# Altium project Motor_Driver.PrjPcb
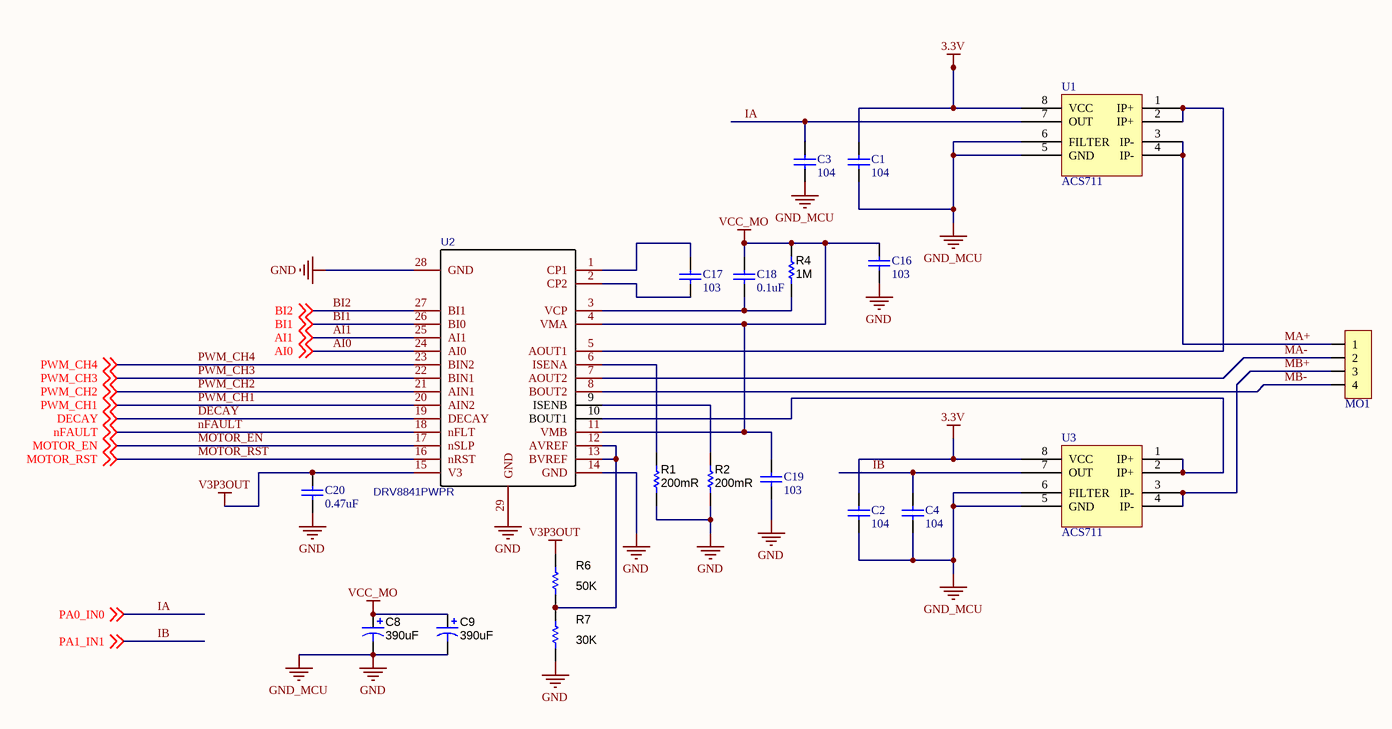
[diagram p0: H_bridge.SchDoc]
2 sheets, 41 parts. Net scope: global (net labels, ports and power ports of the same name join across sheets).
Board files: PCB.PcbDoc, PCB_Step.PcbDoc
Sheets:
  H_bridge.SchDoc
  MCU.SchDoc

## Sheet H_bridge.SchDoc
size B

### Parts
C1  104  [0805_HV]
C2  104  [0805_HV]
C3  104  [0805_HV]
C4  104  [0805_HV]
C8  390uF  [CP1/3.0]
C9  390uF  [CP1/3.0]
C16  103  [0805_HV]
C17  103  [0805_HV]
C18  0.1uF  [0805_HV]
C19  103  [0805_HV]
C20  0.47uF  [0805_HV]
MO1  Header 4_MH  [HEADER 4]  (value not drawn)
R1  ValueDisplayed: 200mR  [1210]  (hidden comment: RT0603DRE07140KL)
R2  ValueDisplayed: 200mR  [1210]  (hidden comment: RT0603DRE07140KL)
R4  1M  [0805_HV]
R6  50K  [0805_HV]
R7  30K  [0805_HV]
U1  ACS711  [SOP 8]
U2  DRV8841PWPR  [TSSOP-28EP]
U3  ACS711  [SOP 8]

### Nets
3.3V: C1.2 C2.2 U1.8(VCC) U3.8(VCC)
GND: C1.1 C2.1 C3.1 C4.1 C8.2(-) C9.2(-) C16.1 C19.1 C20.1 R1.1 R2.1 R7.1 U1.5(GND) U1.6(FILTER) U2.14(GND) U2.28(GND) U2.29(GND) U3.5(GND) U3.6(FILTER)  [also labelled GND_MCU]
V3P3OUT: C20.2 R6.2 U2.15(V3)
VCC_MO: C8.1(+) C9.1(+) C16.2 C18.2 C19.2 R4.2 U2.4(VMA) U2.11(VMB)
AI0: U2.24(AI0) ; off-sheet AI0
AI1: U2.25(AI1) ; off-sheet AI1
BI1: U2.26(BI0) ; off-sheet BI1
BI2: U2.27(BI1) ; off-sheet BI2
DECAY: U2.19(DECAY) ; off-sheet DECAY
IA: C3.2 U1.7(OUT) ; off-sheet PA0_IN0  [also labelled PA0_IN0]
IB: C4.2 U3.7(OUT) ; off-sheet PA1_IN1  [also labelled PA1_IN1]
MA+: MO1.1 U1.3(IP-) U1.4(IP-)
MA-: MO1.2 U2.7(AOUT2)
MB+: MO1.3 U3.3(IP-) U3.4(IP-)
MB-: MO1.4 U2.8(BOUT2)
MOTOR_EN: U2.17(nSLP) ; off-sheet MOTOR_EN
MOTOR_RST: U2.16(nRST) ; off-sheet MOTOR_RST
nFAULT: U2.18(nFLT) ; off-sheet nFAULT
PWM_CH1: U2.20(AIN2) ; off-sheet PWM_CH1
PWM_CH2: U2.21(AIN1) ; off-sheet PWM_CH2
PWM_CH3: U2.22(BIN1) ; off-sheet PWM_CH3
PWM_CH4: U2.23(BIN2) ; off-sheet PWM_CH4
NetC17_1: C17.1 U2.2(CP2)
NetC17_2: C17.2 U2.1(CP1)
NetC18_1: C18.1 R4.1 U2.3(VCP)
NetR1_2: R1.2 U2.6(ISENA)
NetR2_2: R2.2 U2.9(ISENB)
NetR6_1: R6.1 R7.2 U2.12(AVREF) U2.13(BVREF)
NetU1_1: U1.1(IP+) U1.2(IP+) U2.5(AOUT1)
NetU2_10: U2.10(BOUT1) U3.1(IP+) U3.2(IP+)

### Library data of the parts
C1-C4 C16-C20 = Capacitor 0805: Ceramic Chip Capacitor - Standard; Note: Footprint corresponds to dimensions for bulk cassette packaging. This case size has tightened tolerances.; Published: 17-Jul-2002; LatestRevisionDate: 19-Mar-2004; LatestRevisionNote: Silkscreen size reduced.; DatasheetDocument: Mar-2001; PackageDocument: Mar-2001; PackageReference: 0805; Publisher: Altium Limited; Code_JEITA: 0805; Code_IPC: 2012[0805]; ComponentLink1Description: Manufacturer Link; ComponentLink1URL: http://www.kemet.com/; ComponentLink2Description: Datasheet; ComponentLink2URL: http://www.kemet.com/kemet/web/homepage/kechome.nsf/vapubfilesname/F3102TA.pdf/$file/F3102TA.pdf
  C1-C4: Value: 104
  C16 C17 C19: Value: 103
  C18: Value: 0.1uF
  C20: Value: 0.47uF
C8 C9 = Capacitor TuHoa: PartNumber: UHW1H391MPD6; Manufacturer: Nichicon; Polarized: Y; U/M: EA; Cap_F: 0.000390; Tolerance_%: 20; Value1: Unknown; VDC_V: 50; Value2: 50V; TaMin_C: -40; TaMax_C: 105; Cap_Case: 10x22; AEC Category: Q200; AEC Qualified: N; CompType: Capacitor; SymbolVersion: 2008-07-09; Value: 390uF; PackageReference: 10x22; RoHS: Y; MountType: TH; Technology: AL; Series: ZL; Publisher: Texas Instruments; LatestRevisionDate: 2015-12-17; ComponentLink1Description: Datasheet link; ComponentLink1URL: http://nichicon-us.com/english/products/pdfs/e-uhw.pdf; Supplier 1: Digi-Key; Supplier Part Number 1: 493-6885-ND; AEC Grade: N/A; ValueDisplayed: 390uF
MO1 = Header 4_MH: Header 4P XH2.54 thẳng
R1 R2 = RT0603DRE07140KL: RES, 140 k, 0.5%, 0.1 W, 0603; Manufacturer: Yageo America; CompType: Resistor; Value: 140k; Res_ohm: 140000; Tolerance_%: 0.5; Power_W: 0.1; Value2: 0.1W; VDC_V: 75; TempCo: 50 ppm/C; EIA_Code: E192; U/M: EA; SymbolVersion: 2009-05-29; PartNumber: RT0603DRE07140KL; PackageReference: 0603; RoHS: Y; Value_Code: 140k; Value1: 0.5%; MountType: SMT; Technology: Thin Film; Published: 2008-06-26; Publisher: Texas Instruments; LatestRevisionDate: 2014-09-19; ComponentLink1Description: Datasheet link; ComponentLink1URL: http://www.yageo.com/pdf/PYu-RT_1-to-0.05_RoHS_L_3.pdf
R4 R6 R7 = R nho: RES, 100, 1%, 0.1 W, 0402; PartNumber: ERJ-2RKF1000X; Manufacturer: Panasonic; CompType: Resistor; Res_ohm: 100; Value_Code: 100R; Tolerance_%: 1; Power_W: 0.1; Value2: 0.1W; VDC_V: 50; TempCo: 100 ppm/C; EIA_Code: E96; U/M: EA; AEC Category: Q200; SymbolVersion: 2009-05-29; PackageReference: 0402; RoHS: Y; Value1: 1%; MountType: SMT; Technology: Thick Film; Published: 2008-06-26; Publisher: Texas Instruments; LatestRevisionDate: 2016-01-08; ComponentLink1Description: Datasheet link; ComponentLink1URL: http://industrial.panasonic.com/www-data/pdf/AOA0000/AOA0000CE2.pdf; Supplier 1: Digi-Key; Supplier Part Number 1: P100LCT-ND; Supplier 2: Mouser; Supplier Part Number 2: 667-ERJ-2RKF1000X; Supplier 3: Farnell; Supplier Part Number 3: 2304034; AEC Qualified: ?
  R4: Value: 1M
  R6: Value: 50K
  R7: Value: 30K
U1 U3 = ACS712
U2 = DRV8841PWPR: BOM_Manufacturer: TI; SMT Type: Extend; BOM_Supplier: LCSC; BOM_Manufacturer Part: DRV8841PWPR; image: //image.lceda.cn/szlcsc/C36542.jpg; BOM_Supplier Part: C36542; BOM_LCSC Assembly: Yes; spicePre: U

## Sheet MCU.SchDoc
size B
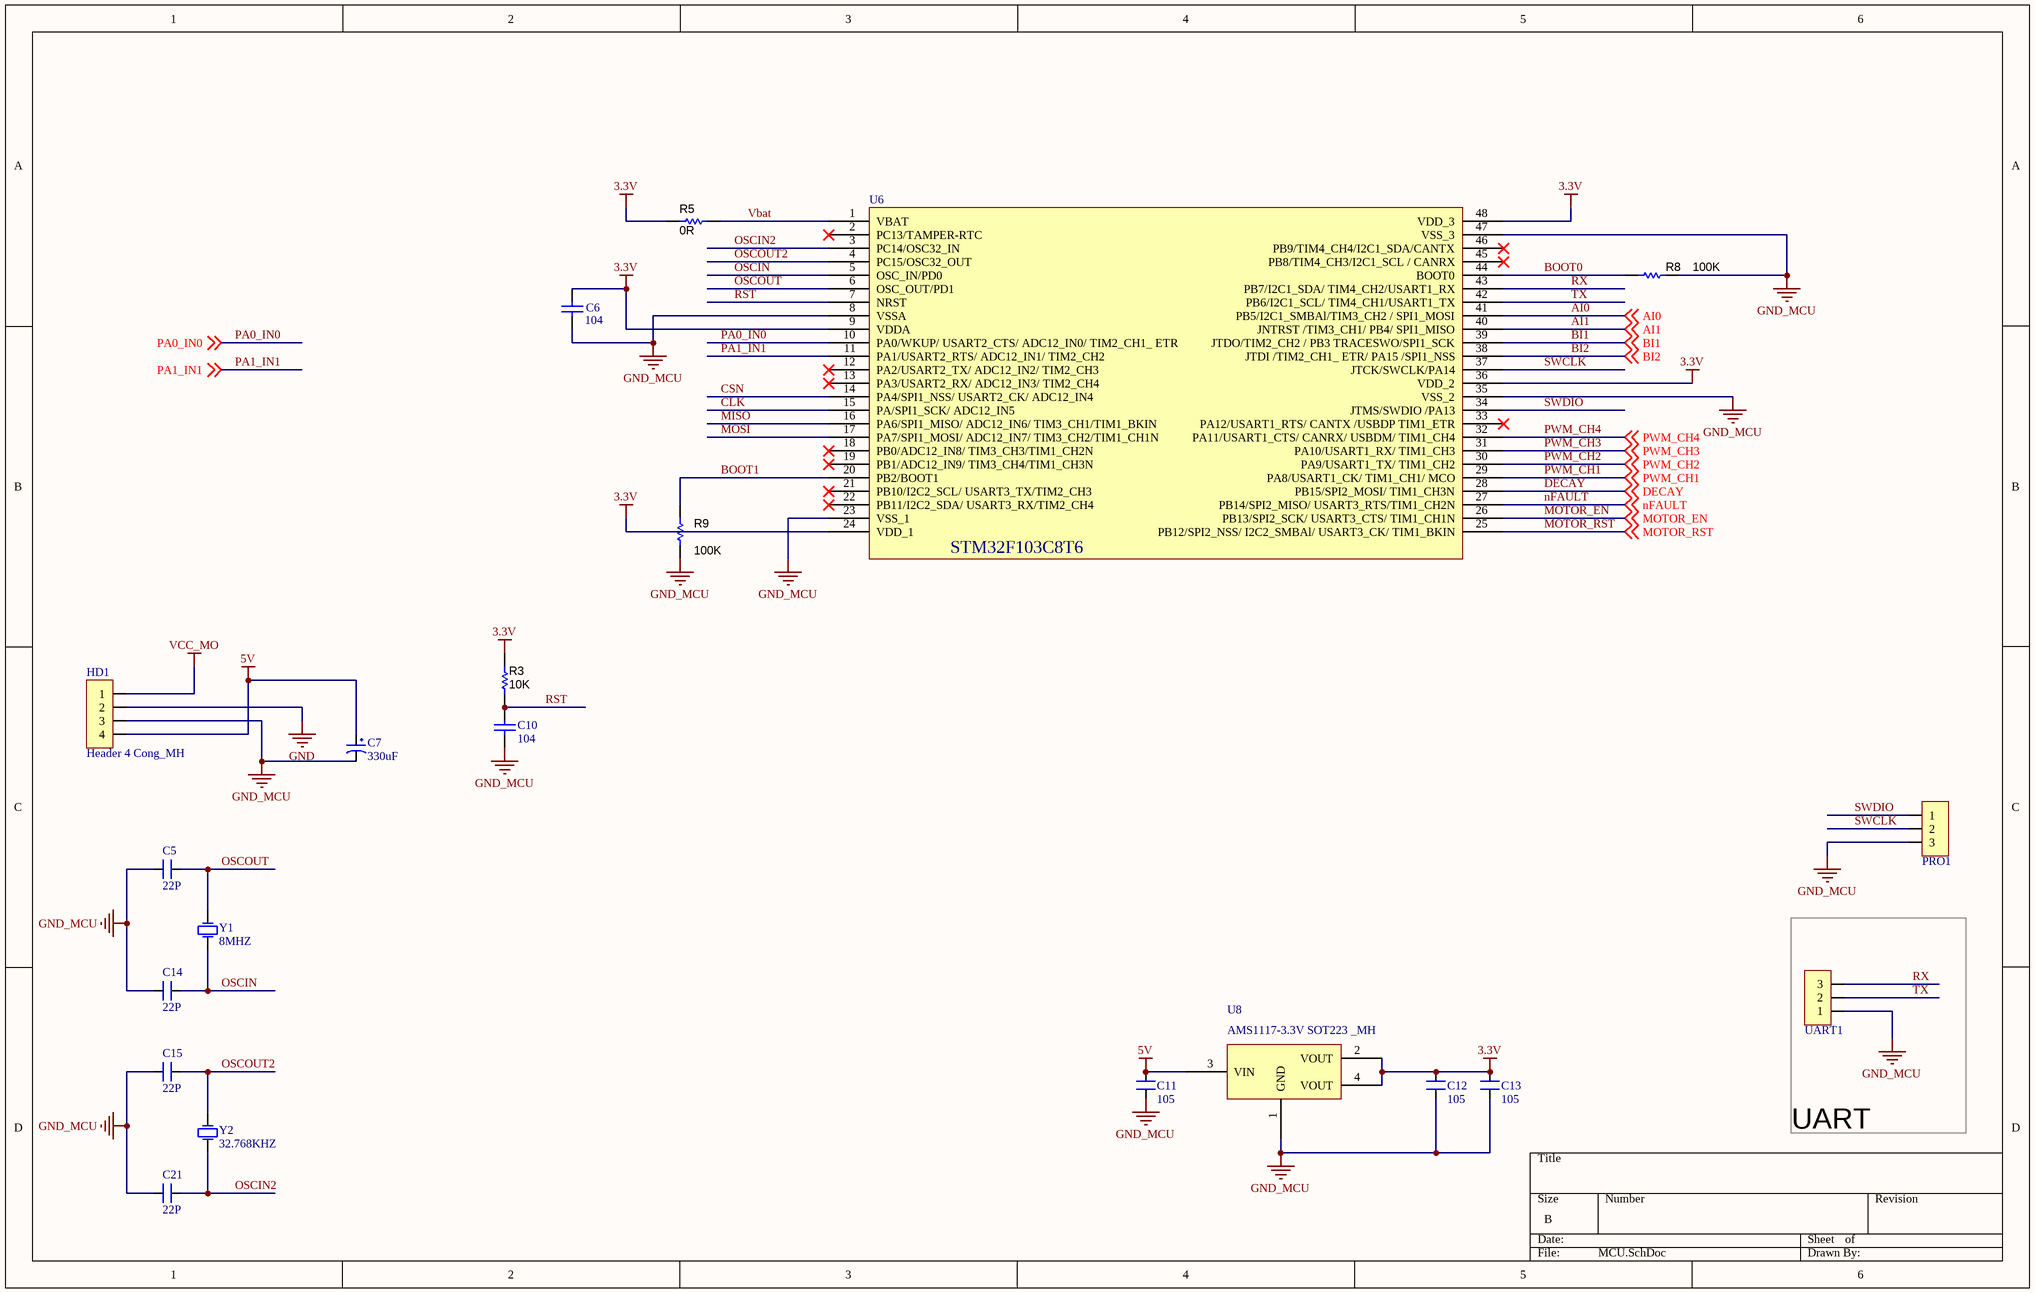
[diagram p1: MCU.SchDoc]

### Parts
C5  22P  [0805_HV]
C6  104  [0805_HV]
C7  330uF  [TU_NHOM_220uF_25V_MH]
C10  104  [0805_HV]
C11  105  [0805_HV]
C12  105  [0805_HV]
C13  105  [0805_HV]
C14  22P  [0805_HV]
C15  22P  [0805_HV]
C21  22P  [0805_HV]
HD1  Header 4 Cong_MH  [HEADER 4]
PRO1  Header 3_MH  [HEADER 3]  (value not drawn)
R3  10K  [0805_HV]
R5  0R  [0805_HV]
R8  100K  [0805_HV]
R9  100K  [0805_HV]
U6  STM32F103C8T6 LQFP48 _MH  [LQFP48]  (value not drawn)
U8  AMS1117-3.3V SOT223 _MH  [SOT223]
UART1  Header 3_MH  [HEADER 3]  (value not drawn)
Y1  8MHZ  [XTAL 49S SMD]
Y2  32.768KHZ  [XT32kn]

### Blocks framed on the sheet
UART: UART1

### Nets
3.3V: C6.2 C12.2 C13.2 R3.2 R5.2 U6.9(VDDA) U6.24(VDD_1) U6.36(VDD_2) U6.48(VDD_3) U8.2(VOUT) U8.4(VOUT)
5V: C7.1 C11.2 HD1.4 U8.3(VIN)
GND: C5.1 C6.1 C7.2 C10.1 C11.1 C12.1 C13.1 C14.1 C15.1 C21.1 HD1.2 HD1.3 PRO1.3 R8.1 R9.2 U6.8(VSSA) U6.23(VSS_1) U6.35(VSS_2) U6.47(VSS_3) U8.1(GND) UART1.1  [also labelled GND_MCU]
VCC_MO: HD1.1
AI0: U6.41(PB5/I2C1_SMBAl/TIM3_CH2_/_SPI1_MOSI) ; off-sheet AI0
AI1: U6.40(JNTRST_/TIM3_CH1/_PB4/_SPI1_MISO) ; off-sheet AI1
BI1: U6.39(JTDO/TIM2_CH2_/_PB3_TRACESWO/SPI1_SCK) ; off-sheet BI1
BI2: U6.38(JTDI_/TIM2_CH1__ETR/_PA15_/SPI1_NSS) ; off-sheet BI2
BOOT0: R8.2 U6.44(BOOT0)
BOOT1: R9.1 U6.20(PB2/BOOT1)
CLK: U6.15(PA/SPI1_SCK/_ADC12_IN5)
CSN: U6.14(PA4/SPI1_NSS/_USART2_CK/_ADC12_IN4)
DECAY: U6.28(PB15/SPI2_MOSI/_TIM1_CH3N) ; off-sheet DECAY
MISO: U6.16(PA6/SPI1_MISO/_ADC12_IN6/_TIM3_CH1/TIM1_BKIN)
MOSI: U6.17(PA7/SPI1_MOSI/_ADC12_IN7/_TIM3_CH2/TIM1_CH1N)
MOTOR_EN: U6.26(PB13/SPI2_SCK/_USART3_CTS/_TIM1_CH1N) ; off-sheet MOTOR_EN
MOTOR_RST: U6.25(PB12/SPI2_NSS/_I2C2_SMBAl/_USART3_CK/_TIM1_BKIN) ; off-sheet MOTOR_RST
nFAULT: U6.27(PB14/SPI2_MISO/_USART3_RTS/TIM1_CH2N) ; off-sheet nFAULT
OSCIN: C14.2 U6.5(OSC_IN/PD0) Y1.2(OSC2)
OSCIN2: C21.2 U6.3(PC14/OSC32_IN) Y2.2(OSC2)
OSCOUT: C5.2 U6.6(OSC_OUT/PD1) Y1.1(OSC1)
OSCOUT2: C15.2 U6.4(PC15/OSC32_OUT) Y2.1(OSC1)
PA0_IN0: U6.10(PA0/WKUP/_USART2_CTS/_ADC12_IN0/_TIM2_CH1__ETR) ; off-sheet PA0_IN0  [project net IA]
PA1_IN1: U6.11(PA1/USART2_RTS/_ADC12_IN1/_TIM2_CH2) ; off-sheet PA1_IN1  [project net IB]
PWM_CH1: U6.29(PA8/USART1_CK/_TIM1_CH1/_MCO) ; off-sheet PWM_CH1
PWM_CH2: U6.30(PA9/USART1_TX/_TIM1_CH2) ; off-sheet PWM_CH2
PWM_CH3: U6.31(PA10/USART1_RX/_TIM1_CH3) ; off-sheet PWM_CH3
PWM_CH4: U6.32(PA11/USART1_CTS/_CANRX/_USBDM/_TIM1_CH4) ; off-sheet PWM_CH4
RST: C10.2 R3.1 U6.7(NRST)
RX: U6.43(PB7/I2C1_SDA/_TIM4_CH2/USART1_RX) UART1.3
SWCLK: PRO1.2 U6.37(JTCK/SWCLK/PA14)
SWDIO: PRO1.1 U6.34(JTMS/SWDIO_/PA13)
TX: U6.42(PB6/I2C1_SCL/_TIM4_CH1/USART1_TX) UART1.2
Vbat: R5.1 U6.1(VBAT)

Not connected (* = marked no-connect by the designer): U6 2(PC13/TAMPER-RTC)* 12(PA2/USART2_TX/_ADC12_IN2/_TIM2_CH3)* 13(PA3/USART2_RX/_ADC12_IN3/_TIM2_CH4)* 18(PB0/ADC12_IN8/_TIM3_CH3/TIM1_CH2N)* 19(PB1/ADC12_IN9/_TIM3_CH4/TIM1_CH3N)* 21(PB10/I2C2_SCL/_USART3_TX/TIM2_CH3)* 22(PB11/I2C2_SDA/_USART3_RX/TIM2_CH4)* 33(PA12/USART1_RTS/_CANTX_/USBDP_TIM1_ETR)* 45(PB8/TIM4_CH3/I2C1_SCL_/_CANRX)* 46(PB9/TIM4_CH4/I2C1_SDA/CANTX)*

### Notes on the sheet
- (in symbol STM32F103C8T6 LQFP48 _MH) STM32F103C8T6

### Library data of the parts
C5 C11-C15 C21 = CM: Cap SMD; Value: 103
C6 C10 = Capacitor 0805: as C1 on sheet H_bridge; Published: 17-Jul-2002; LatestRevisionDate: 19-Mar-2004; LatestRevisionNote: Silkscreen size reduced.; DatasheetDocument: Mar-2001; PackageDocument: Mar-2001; PackageReference: 0805; Publisher: Altium Limited; Code_JEITA: 0805; Code_IPC: 2012[0805]; ComponentLink1Description: Manufacturer Link; ComponentLink1URL: http://www.kemet.com/; ComponentLink2Description: Datasheet; ComponentLink2URL: http://www.kemet.com/kemet/web/homepage/kechome.nsf/vapubfilesname/F3102TA.pdf/$file/F3102TA.pdf; Value: 104
C7 = TU_NHOM_330uF_16V_MH: Value: 47uF/16 - 50V; Description 1: 470uF/6,3V - 330uF/10V - 220uF/16V; Description 2: 100uF/25V - 35V - 47uF/50V - 22uF/100V; Description 3: 33uF => 47uF/63V - 1uF => 4,7uF/160V; Description 4: 1uF => 2,2uF/250V - 1uF/350V
HD1 = Header 4 Cong_MH: Header 4P XH2.54 cong
PRO1 UART1 = Header 3_MH: Header 3P XH2.54 thẳng
R3 R5 R8 R9 = R nho: as R4 on sheet H_bridge; SymbolVersion: 2009-05-29; PackageReference: 0402; RoHS: Y; Value1: 1%; MountType: SMT; Technology: Thick Film; Published: 2008-06-26; Publisher: Texas Instruments; LatestRevisionDate: 2016-01-08; ComponentLink1Description: Datasheet link; ComponentLink1URL: http://industrial.panasonic.com/www-data/pdf/AOA0000/AOA0000CE2.pdf; Supplier 1: Digi-Key; Supplier Part Number 1: P100LCT-ND; Supplier 2: Mouser; Supplier Part Number 2: 667-ERJ-2RKF1000X; Supplier 3: Farnell; Supplier Part Number 3: 2304034; AEC Qualified: ?
  R3: Value: 10K
  R5: Value: 0R
  R8 R9: Value: 100K
Y1 Y2 = CRYSTAL_49S DIP_MH: Crystal Oscillator; Published: 8-Jun-2000; LatestRevisionDate: 17-Jul-2002; LatestRevisionNote: Re-released for DXP Platform.; PackageReference: R38; Publisher: Altium Limited

## Nets that join several sheets
3.3V: H_bridge (C1.2 C2.2 U1.8 U3.8), MCU (11 pins)
GND: H_bridge (19 pins), MCU (21 pins)
VCC_MO: H_bridge (8 pins), MCU (HD1.1)
AI0: H_bridge (U2.24), MCU (U6.41)
AI1: H_bridge (U2.25), MCU (U6.40)
BI1: H_bridge (U2.26), MCU (U6.39)
BI2: H_bridge (U2.27), MCU (U6.38)
DECAY: H_bridge (U2.19), MCU (U6.28)
IA: H_bridge (C3.2 U1.7), MCU (U6.10)
IB: H_bridge (C4.2 U3.7), MCU (U6.11)
MOTOR_EN: H_bridge (U2.17), MCU (U6.26)
MOTOR_RST: H_bridge (U2.16), MCU (U6.25)
nFAULT: H_bridge (U2.18), MCU (U6.27)
PWM_CH1: H_bridge (U2.20), MCU (U6.29)
PWM_CH2: H_bridge (U2.21), MCU (U6.30)
PWM_CH3: H_bridge (U2.22), MCU (U6.31)
PWM_CH4: H_bridge (U2.23), MCU (U6.32)